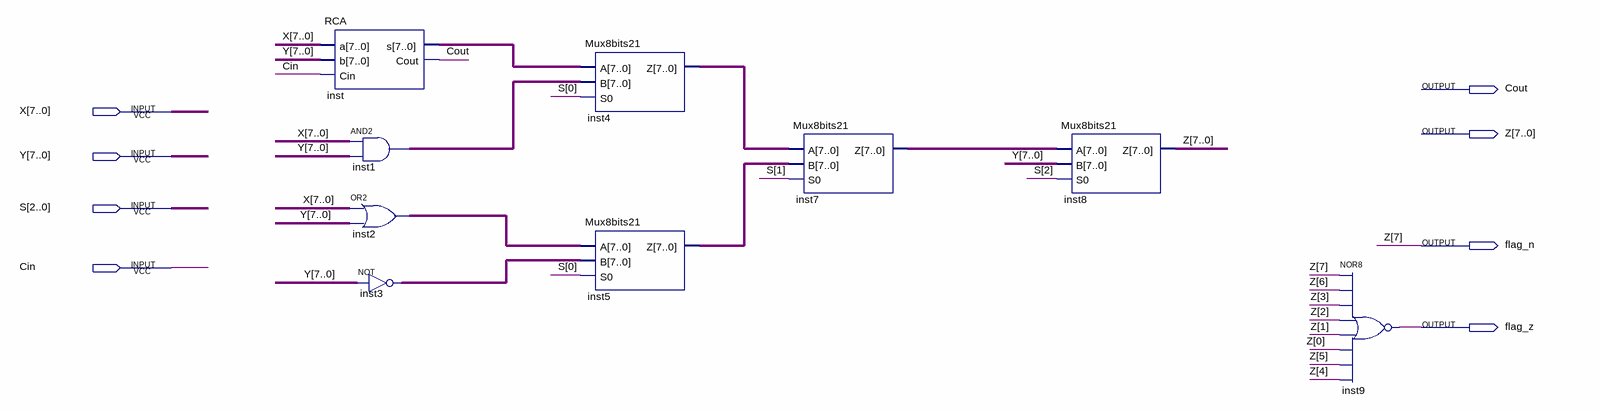
[diagram p0: schematic sheet]
// Quartus schematic ULA.bdf as structural Verilog: 9 symbols, 8 pins
module ULA (
  input  [7:0] X,
  input  [7:0] Y,
  input  [2:0] S,
  input  Cin,
  output Cout,
  output [7:0] Z,
  output flag_n,
  output flag_z
);

  wire [7:0] inst1_out, inst2_out, inst3_out, inst4_z, inst5_z, inst7_z, inst_s;

  RCA inst (.a(X), .b(Y), .Cin(Cin), .s(inst_s), .Cout(Cout));
  assign inst1_out = X & Y;  // AND2 inst1, 8 bits wide
  assign inst2_out = X | Y;  // OR2 inst2, 8 bits wide
  assign inst3_out = ~Y;  // NOT inst3, 8 bits wide
  Mux8bits21 inst4 (.A(inst_s), .B(inst1_out), .S0(S[0]), .Z(inst4_z));
  Mux8bits21 inst5 (.A(inst2_out), .B(inst3_out), .S0(S[0]), .Z(inst5_z));
  Mux8bits21 inst7 (.A(inst4_z), .B(inst5_z), .S0(S[1]), .Z(inst7_z));
  Mux8bits21 inst8 (.A(inst7_z), .B(Y), .S0(S[2]), .Z({flag_n, Z[6:0]}));
  nor inst9 (flag_z, flag_n, Z[6], Z[3], Z[2], Z[1], Z[0], Z[5], Z[4]);

  assign Z[7] = flag_n;
endmodule
